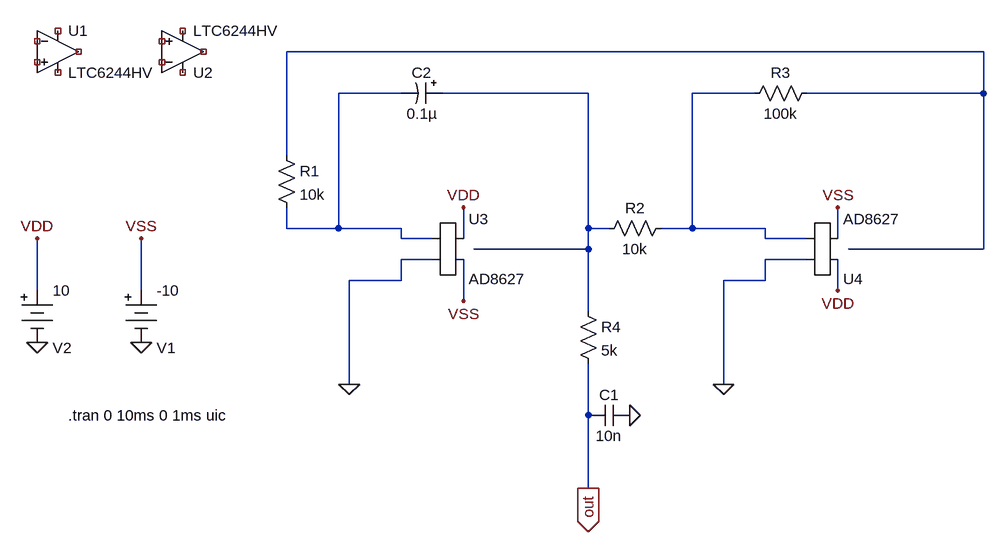
[diagram p0: schematic RC oscillator, square, triangular and sine with AD8627.asc]
RC oscillator, square, triangular and sine with AD8627.asc, the LTspice schematic file:
Version 4
SHEET 1 1252 680
WIRE 1232 -272 160 -272
WIRE 336 -208 240 -208
WIRE 624 -208 400 -208
WIRE 880 -208 784 -208
WIRE 1232 -208 1232 -272
WIRE 1232 -208 960 -208
WIRE 160 -112 160 -272
WIRE 160 0 160 -32
WIRE 240 0 240 -208
WIRE 240 0 160 0
WIRE 336 0 240 0
WIRE 624 0 624 -208
WIRE 656 0 624 0
WIRE 784 0 784 -208
WIRE 784 0 736 0
WIRE 896 0 784 0
WIRE 336 16 336 0
WIRE 384 16 336 16
WIRE 432 16 432 -32
WIRE 896 16 896 0
WIRE 960 16 896 16
WIRE 1008 16 1008 -32
WIRE 464 32 448 32
WIRE 624 32 624 0
WIRE 624 32 464 32
WIRE 1040 32 1024 32
WIRE 1232 32 1232 -208
WIRE 1232 32 1040 32
WIRE 384 48 336 48
WIRE 960 48 896 48
WIRE 336 80 336 48
WIRE 336 80 256 80
WIRE 896 80 896 48
WIRE 896 80 832 80
WIRE -224 96 -224 16
WIRE -64 96 -64 16
WIRE 1008 96 1008 48
WIRE 432 112 432 48
WIRE 624 128 624 32
WIRE 256 240 256 80
WIRE 832 240 832 80
WIRE 624 288 624 208
WIRE 624 400 624 288
FLAG 256 240 0
FLAG 832 240 0
FLAG -64 176 0
FLAG -224 176 0
FLAG 688 288 0
FLAG 432 -32 VDD
FLAG 1008 96 VDD
FLAG 432 112 VSS
FLAG 1008 -32 VSS
FLAG -224 16 VDD
FLAG -64 16 VSS
FLAG 624 400 out
IOPIN 624 400 Out
SYMBOL res 144 -128 R0
SYMATTR InstName R1
SYMATTR Value 10k
SYMBOL res 752 -16 R90
WINDOW 0 0 56 VBottom 2
WINDOW 3 32 56 VTop 2
SYMATTR InstName R2
SYMATTR Value 10k
SYMBOL res 976 -224 R90
WINDOW 0 0 56 VBottom 2
WINDOW 3 32 56 VTop 2
SYMATTR InstName R3
SYMATTR Value 100k
SYMBOL polcap 400 -224 R90
WINDOW 0 0 32 VBottom 2
WINDOW 3 32 32 VTop 2
SYMATTR InstName C2
SYMATTR Value 0.1µ
SYMBOL Misc\\battery -64 80 R0
WINDOW 0 24 104 Left 2
WINDOW 3 24 16 Left 2
WINDOW 123 0 0 Left 0
WINDOW 39 0 0 Left 0
SYMATTR InstName V1
SYMATTR Value -10
SYMBOL Misc\\battery -224 80 R0
WINDOW 0 24 104 Left 2
WINDOW 3 24 16 Left 2
WINDOW 123 0 0 Left 0
WINDOW 39 0 0 Left 0
SYMATTR InstName V2
SYMATTR Value 10
SYMBOL res 608 112 R0
SYMATTR InstName R4
SYMATTR Value 5k
SYMBOL cap 688 272 R90
WINDOW 0 0 32 VBottom 2
WINDOW 3 32 32 VTop 2
SYMATTR InstName C1
SYMATTR Value 10n
SYMBOL OpAmps\\LTC6244HV -192 -272 R0
SYMATTR InstName U1
SYMBOL OpAmps\\LTC6244HV 0 -272 M180
SYMATTR InstName U2
SYMBOL AutoGenerated\\AD8627 416 32 R0
SYMATTR InstName U3
SYMBOL AutoGenerated\\AD8627 992 32 M180
SYMATTR InstName U4
TEXT -176 288 Left 2 !.tran 0 10ms 0 1ms uic

The netlist it stands for:
* RC oscillator, square, triangular and sine with AD8627.asc
R1 N001 N002 10k
R2 N004 N003 10k
R3 N001 N004 100k
C2 N003 N002 0.1µ
V1 VSS 0 -10
V2 VDD 0 10
R4 N003 out 5k
C1 0 out 10n
XU1 NC_01 NC_02 NC_03 NC_04 NC_05 LTC6244HV  ; pins In+ In- V+ V- OUT
XU2 NC_06 NC_07 NC_08 NC_09 NC_10 LTC6244HV  ; pins In+ In- V+ V- OUT
* U3: AD8627 (symbol AutoGenerated\AD8627 not available, pins judged from their places): pin1=N002 pin2=0 pin3=VDD pin4=VSS
* U4: AD8627 (symbol AutoGenerated\AD8627 not available, pins judged from their places): pin1=0 pin2=N004 pin3=VDD pin4=VSS
.tran 0 10ms 0 1ms uic
.lib LTC5.lib
.backanno
.end